# Altium schematic sheet 04_LEDs.SchDoc: ECE315 Analog
size A; Date: 4/25/2017; ApprovedBy: JSK; CheckedBy: JSK; Author: JSK; CompanyName: University of Wisconsin; DrawnBy: JSK; Engineer: JSK; Organization: ECE 315; Address1: College of Engineering; Address2: 1415 Engineering Drive; Address3: Madison, WI 53706; Address4: ECE 315 Fall 2017; Revision: A; SheetNumber: 2; SheetTotal: 2; AssemblyNumber: ECE315-F19; ApprovedDate: 04/02/2019
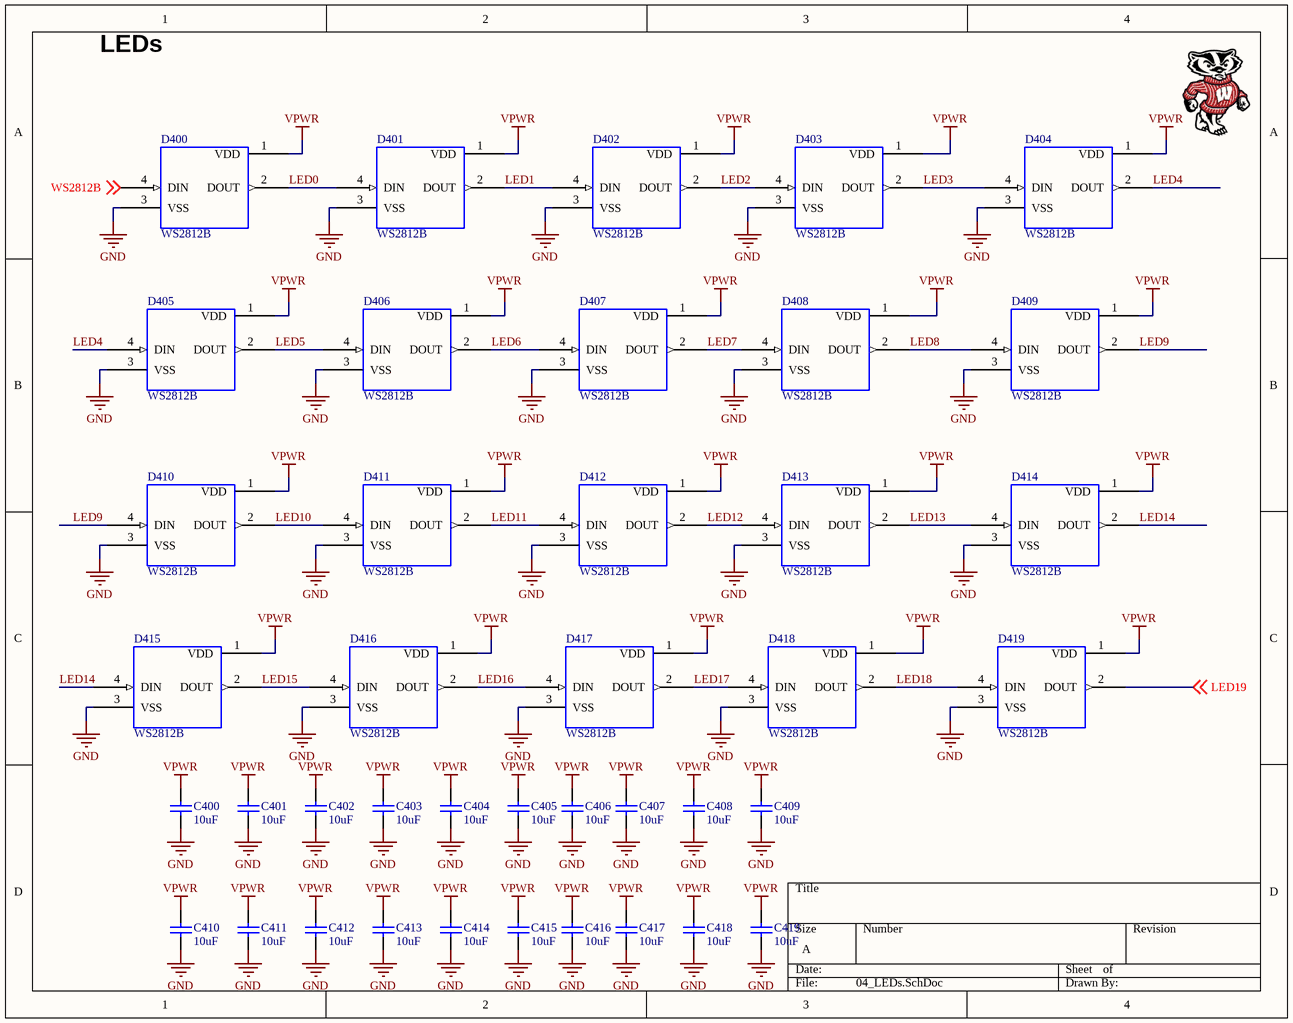
[diagram p0: 04_LEDs.SchDoc]

## Parts
C400  10uF  [CAP_0805]
C401  10uF  [CAP_0805]
C402  10uF  [CAP_0805]
C403  10uF  [CAP_0805]
C404  10uF  [CAP_0805]
C405  10uF  [CAP_0805]
C406  10uF  [CAP_0805]
C407  10uF  [CAP_0805]
C408  10uF  [CAP_0805]
C409  10uF  [CAP_0805]
C410  10uF  [CAP_0805]
C411  10uF  [CAP_0805]
C412  10uF  [CAP_0805]
C413  10uF  [CAP_0805]
C414  10uF  [CAP_0805]
C415  10uF  [CAP_0805]
C416  10uF  [CAP_0805]
C417  10uF  [CAP_0805]
C418  10uF  [CAP_0805]
C419  10uF  [CAP_0805]
D400  WS2812B  [WS2812B]
D401  WS2812B  [WS2812B]
D402  WS2812B  [WS2812B]
D403  WS2812B  [WS2812B]
D404  WS2812B  [WS2812B]
D405  WS2812B  [WS2812B]
D406  WS2812B  [WS2812B]
D407  WS2812B  [WS2812B]
D408  WS2812B  [WS2812B]
D409  WS2812B  [WS2812B]
D410  WS2812B  [WS2812B]
D411  WS2812B  [WS2812B]
D412  WS2812B  [WS2812B]
D413  WS2812B  [WS2812B]
D414  WS2812B  [WS2812B]
D415  WS2812B  [WS2812B]
D416  WS2812B  [WS2812B]
D417  WS2812B  [WS2812B]
D418  WS2812B  [WS2812B]
D419  WS2812B  [WS2812B]

## Nets
GND: C400.1 C401.1 C402.1 C403.1 C404.1 C405.1 C406.1 C407.1 C408.1 C409.1 C410.1 C411.1 C412.1 C413.1 C414.1 C415.1 C416.1 C417.1 C418.1 C419.1 D400.3(VSS) D401.3(VSS) D402.3(VSS) D403.3(VSS) D404.3(VSS) D405.3(VSS) D406.3(VSS) D407.3(VSS) D408.3(VSS) D409.3(VSS) D410.3(VSS) D411.3(VSS) D412.3(VSS) D413.3(VSS) D414.3(VSS) D415.3(VSS) D416.3(VSS) D417.3(VSS) D418.3(VSS) D419.3(VSS)
VPWR: C400.2 C401.2 C402.2 C403.2 C404.2 C405.2 C406.2 C407.2 C408.2 C409.2 C410.2 C411.2 C412.2 C413.2 C414.2 C415.2 C416.2 C417.2 C418.2 C419.2 D400.1(VDD) D401.1(VDD) D402.1(VDD) D403.1(VDD) D404.1(VDD) D405.1(VDD) D406.1(VDD) D407.1(VDD) D408.1(VDD) D409.1(VDD) D410.1(VDD) D411.1(VDD) D412.1(VDD) D413.1(VDD) D414.1(VDD) D415.1(VDD) D416.1(VDD) D417.1(VDD) D418.1(VDD) D419.1(VDD)
LED0: D400.2(DOUT) D401.4(DIN)
LED1: D401.2(DOUT) D402.4(DIN)
LED2: D402.2(DOUT) D403.4(DIN)
LED3: D403.2(DOUT) D404.4(DIN)
LED4: D404.2(DOUT) D405.4(DIN)
LED5: D405.2(DOUT) D406.4(DIN)
LED6: D406.2(DOUT) D407.4(DIN)
LED7: D407.2(DOUT) D408.4(DIN)
LED8: D408.2(DOUT) D409.4(DIN)
LED9: D409.2(DOUT) D410.4(DIN)
LED10: D410.2(DOUT) D411.4(DIN)
LED11: D411.2(DOUT) D412.4(DIN)
LED12: D412.2(DOUT) D413.4(DIN)
LED13: D413.2(DOUT) D414.4(DIN)
LED14: D414.2(DOUT) D415.4(DIN)
LED15: D415.2(DOUT) D416.4(DIN)
LED16: D416.2(DOUT) D417.4(DIN)
LED17: D417.2(DOUT) D418.4(DIN)
LED18: D418.2(DOUT) D419.4(DIN)
LED19: D419.2(DOUT) ; off-sheet LED19
WS2812B: D400.4(DIN) ; off-sheet WS2812B

## Notes on the sheet
- LEDs

## Library data of the parts
C400-C419 = CAP_0805_U_010.00: CAP CER 10UF 16V X7R 0805; Manufacturer: Samsung; Manufacturer Part Number: CL21A106KPCLQNC; Tolerance: 10%; Voltage Rating: 10V; Dielectric: X5R; ComponentLink3URL: https://datasheet.ciiva.com/26920/getdatasheetpartid-355170-26920201.pdf; ComponentLink3Description: https://datasheet.ciiva.com/26920/getdatasheetpartid-355170-26920201.pdf; Supplier 1: Digi-Key; Stock 1: 40000; Pricing 1: 1=0.22, 10=0.148, 100=0.0749, 500=0.05122, 1000=0.04531 (USD); Mount: Surface Mount; Case/Package: 0805; Case Code (Metric): 2012; Case Code (Imperial): 0805; Contact Plating: Tin; Min Operating Temperature: -55°C; Max Operating Temperature: 85°C; Packaging: Tape and Reel; Package Quantity: 1; Length: 2mm; Height: 0.85mm; Width: 0.049inch; Thickness: 0.037inch; Depth: 1.25mm; Radiation Hardening: No; ComponentLink1URL: https://datasheet.ciiva.com/25730/cl21a106kpclqnc-25730594.pdf; ComponentLink1Description: https://datasheet.ciiva.com/25730/cl21a106kpclqnc-25730594.pdf; Supplier Part Number 1: 1276-2402-1-ND; Capacitance: 10uF
D400-D419 = WS2812B: LED RGB WS2812B; Manufacturer Part Number: EBAY; Rating: 3.5V-5.3V; Value: WS2812B